# EAGLE board MCAT-CANYVAL-BPL-5X (EAGLE 7.2.0), part 1 of 2
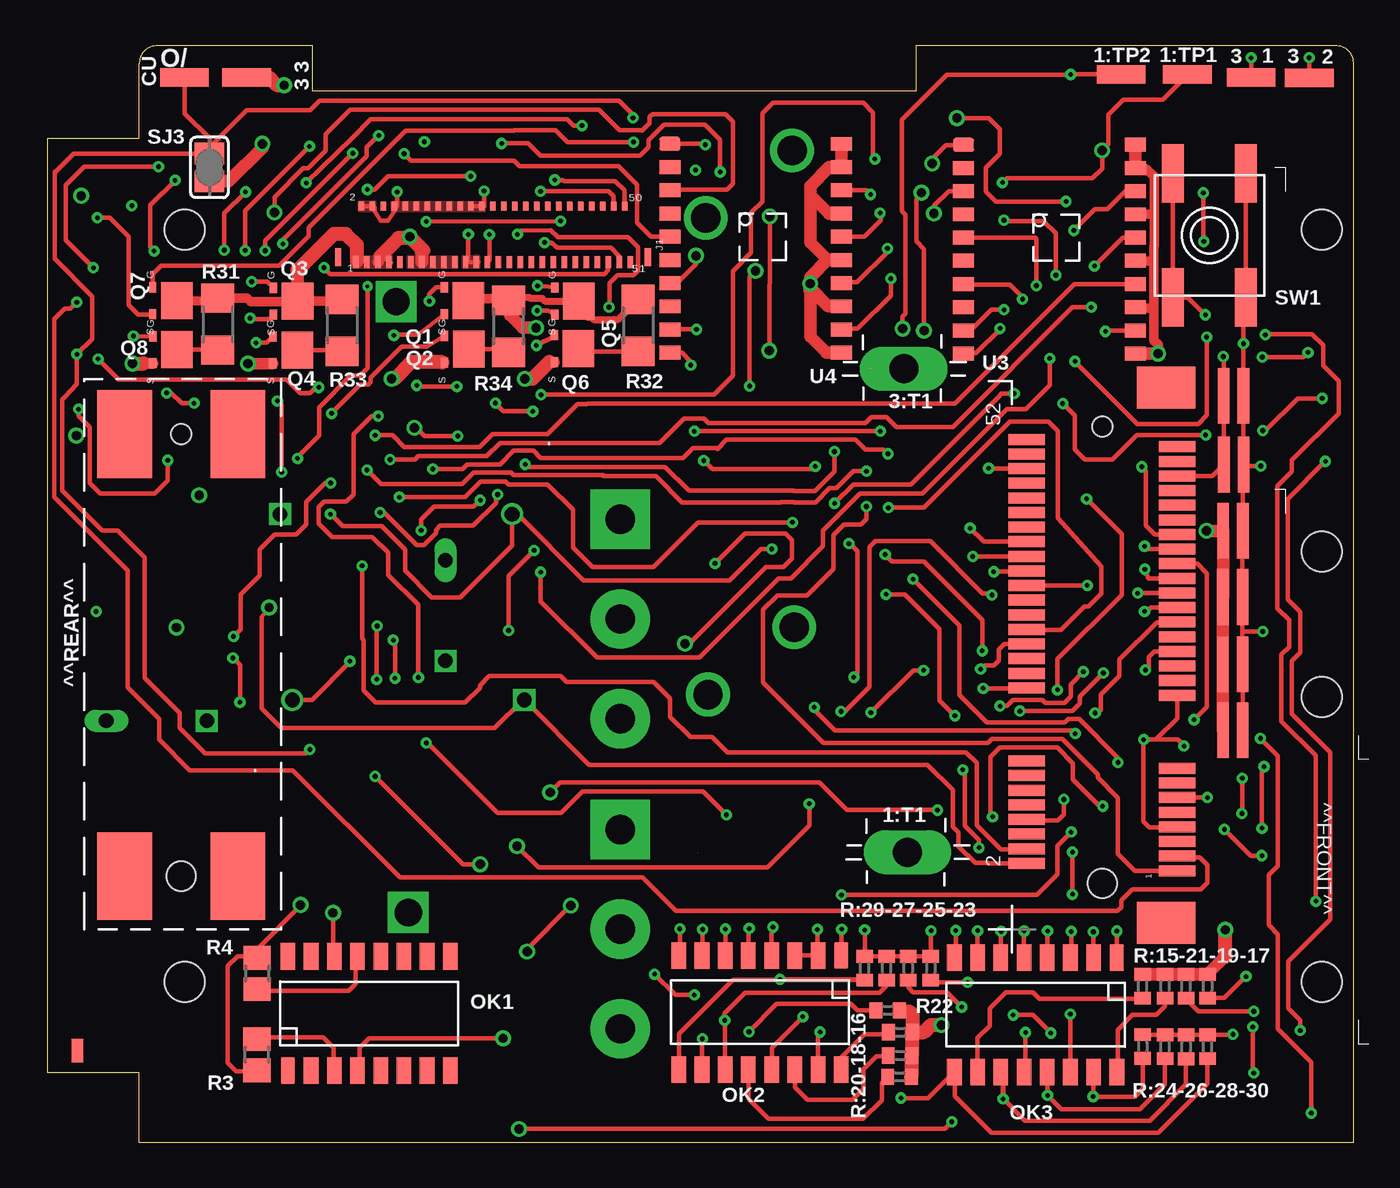
[diagram p4: board, top side]
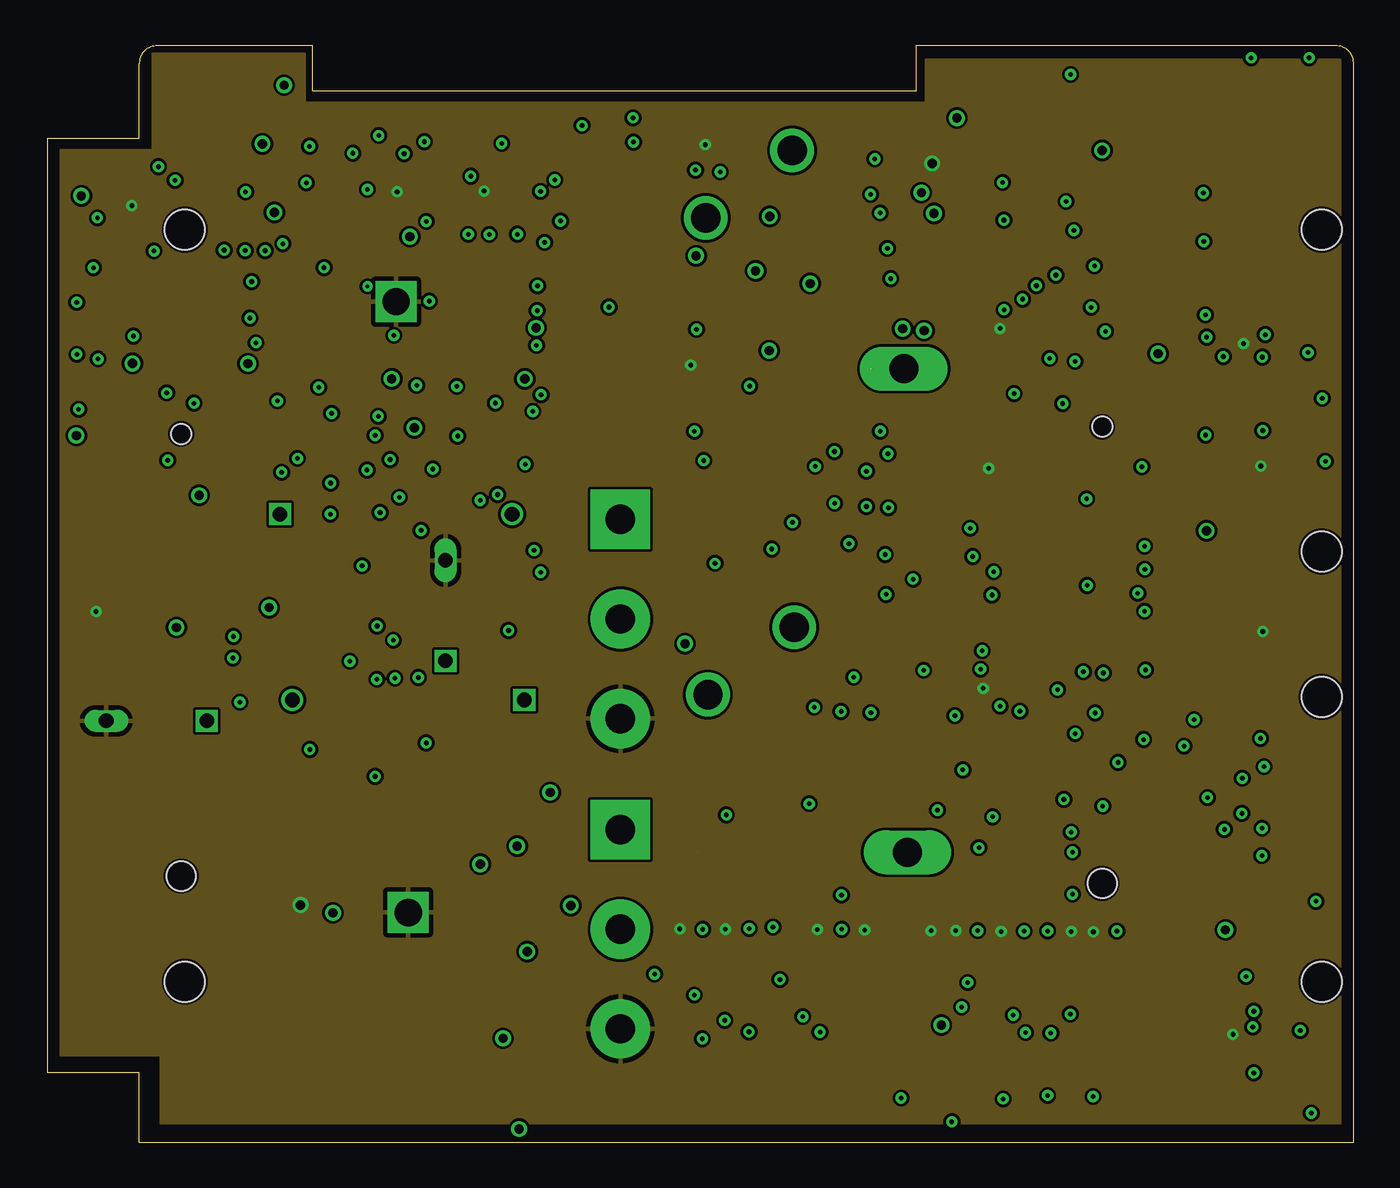
[diagram p5: board, inner layer L2/TopGround]
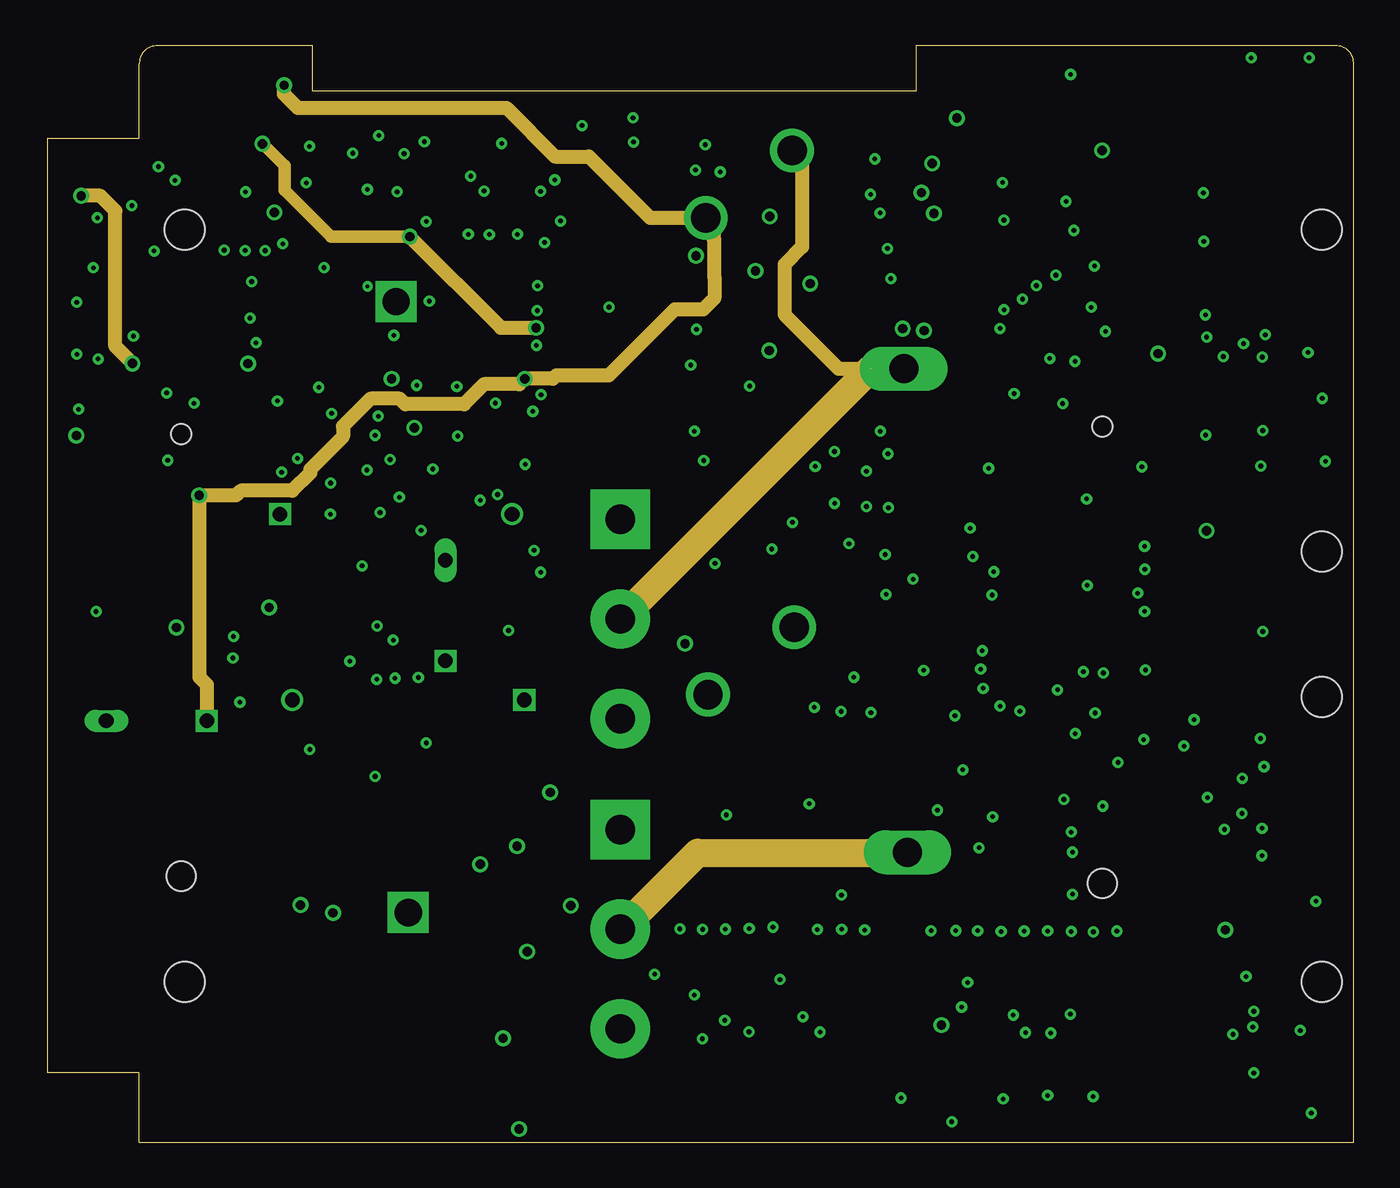
[diagram p6: board, inner layer L3/Power1]
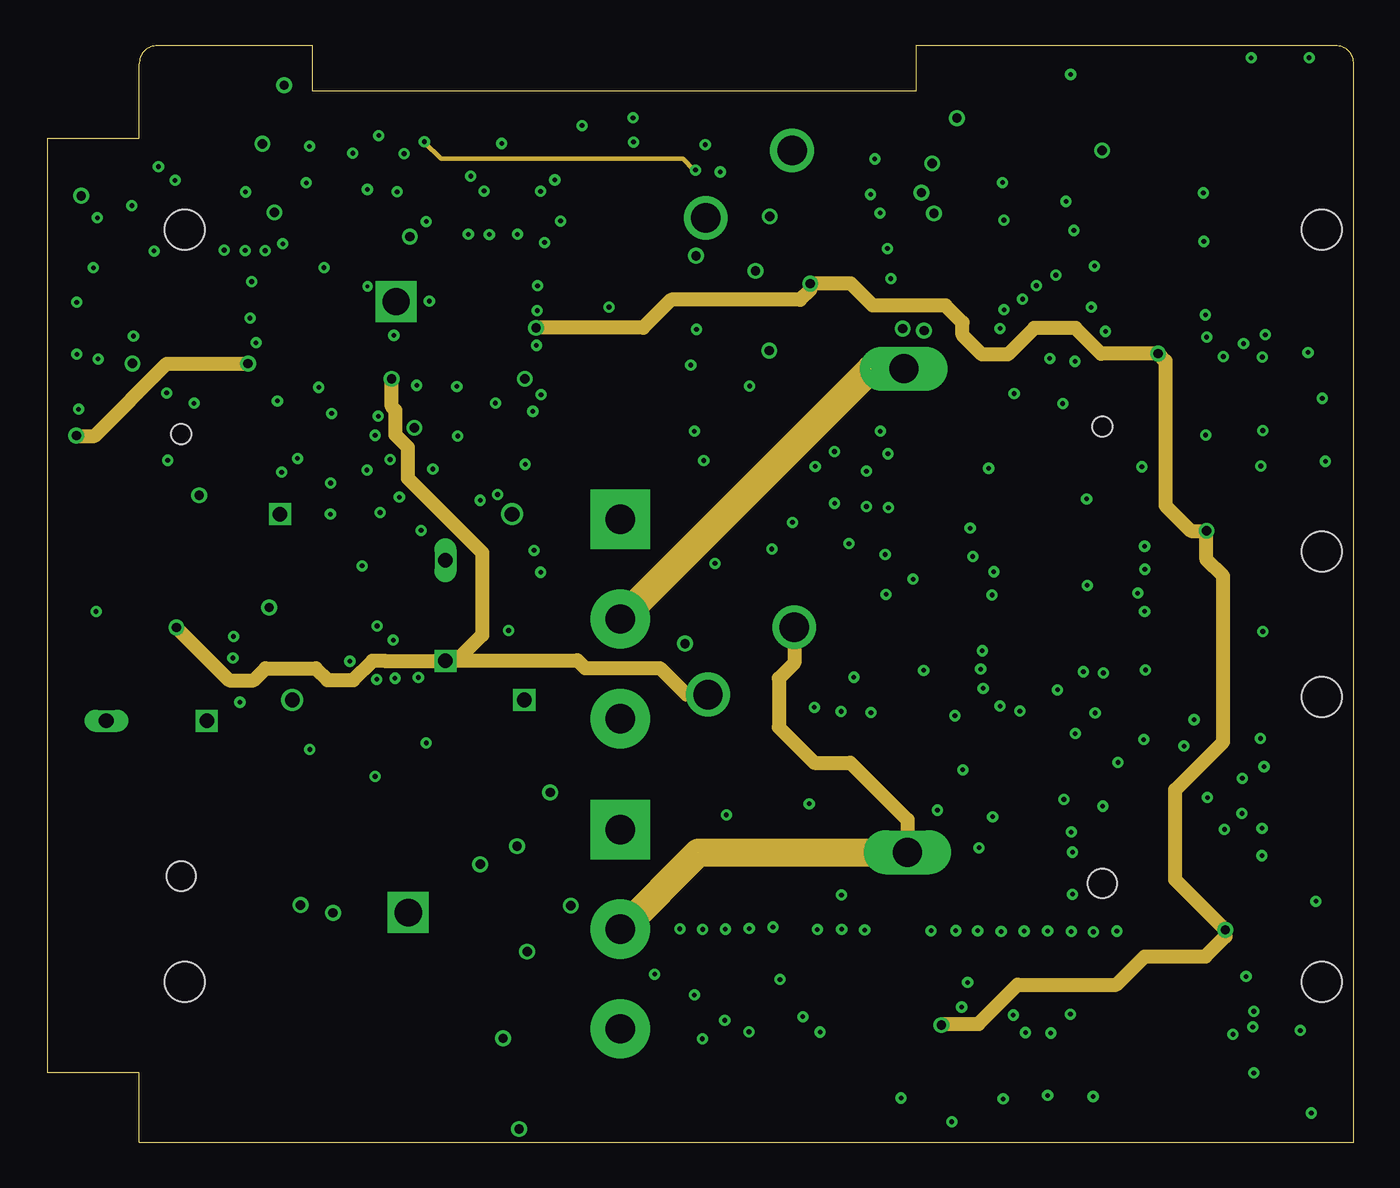
[diagram p7: board, inner layer L14/Power2]
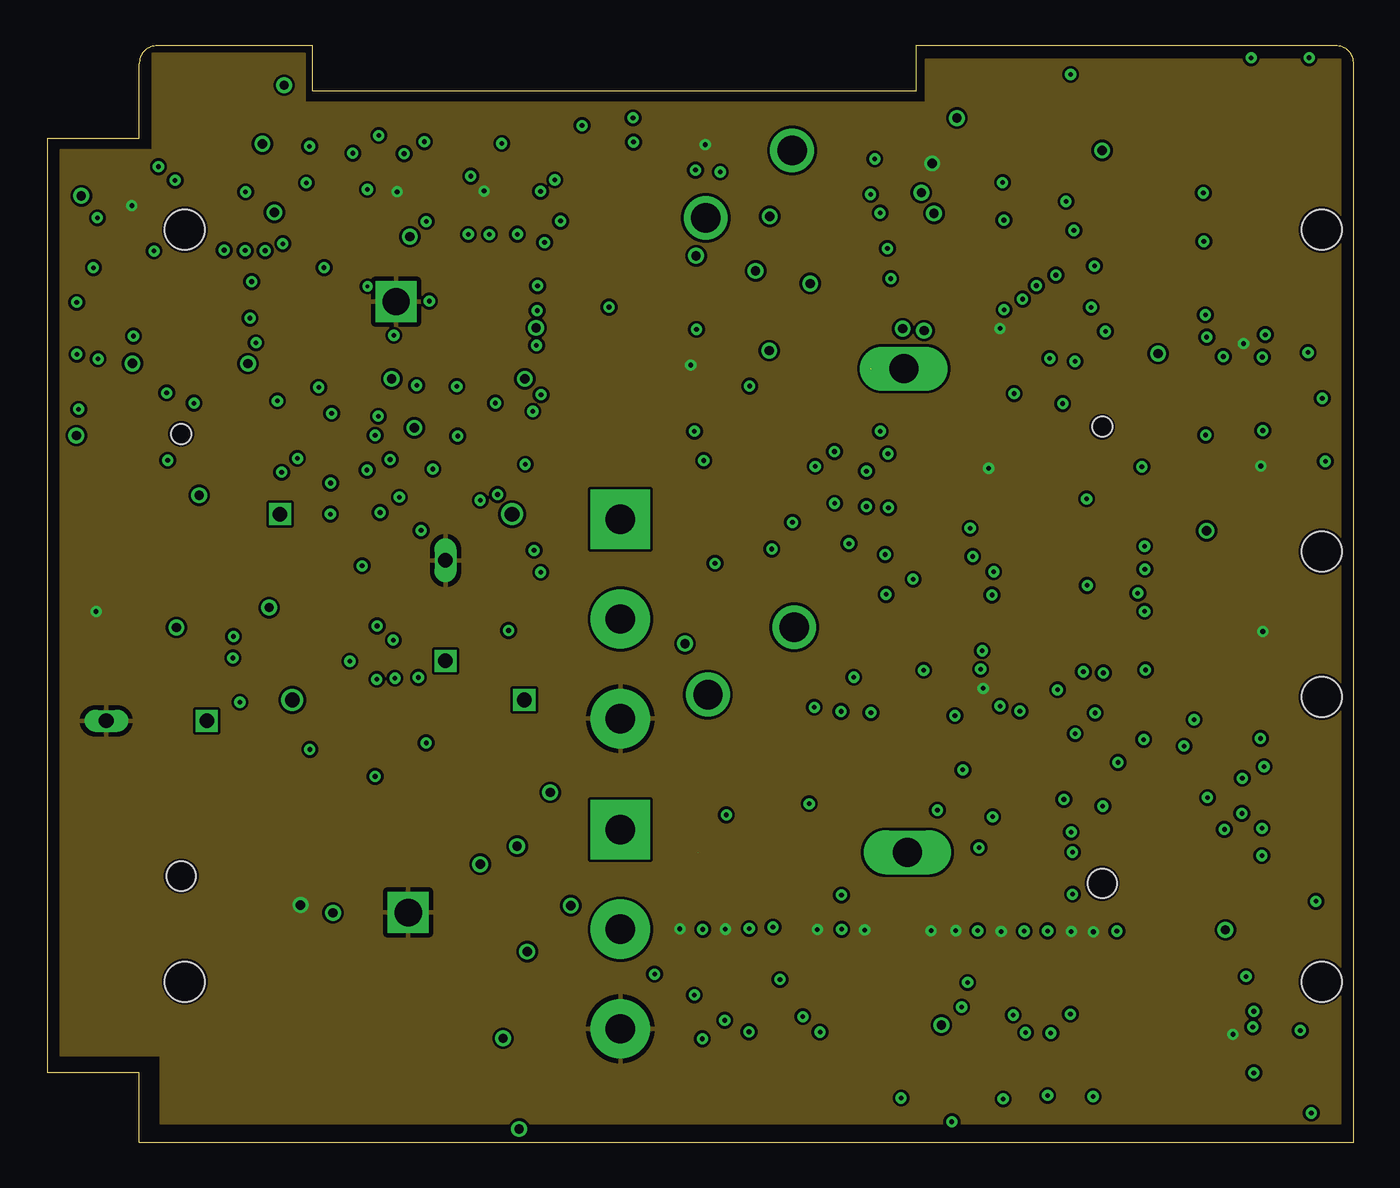
[diagram p8: board, inner layer L15/BottomGround]
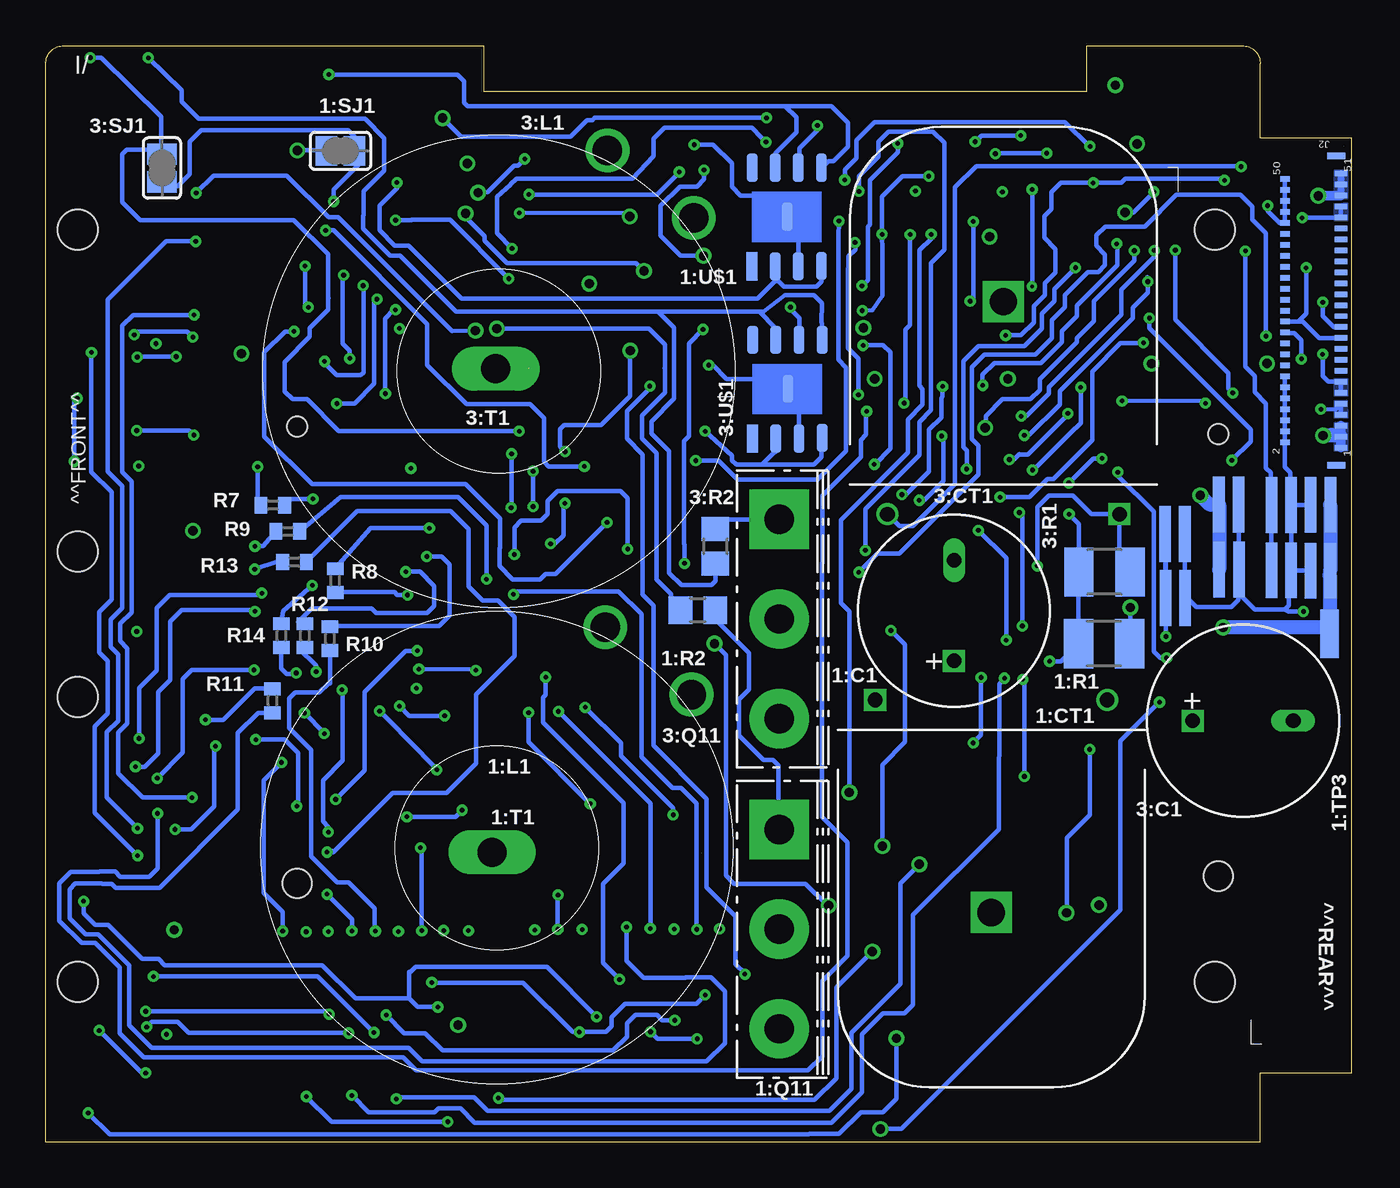
[diagram p9: board, bottom side, seen from below]

Size 71.47 x 60 mm. Coordinates in mm from the lower left corner, seen from the top.
Copper layers (1+2*3+14*15+16): L1/TopSignal 0.035559375mm / dielectric 3.5mil / L2/TopGround 0.01778125mm / dielectric 47mil / L3/Power1 0.0356mm / dielectric 12mil / L14/Power2 0.0356mm / dielectric 0.1499mm / L15/BottomGround 0.01778125mm / dielectric 3.5mil / L16/BottomSignal 0.035559375mm
Design rules "mcat-4cu-c *": minimum track width 2mil, minimum drill 8mil, track to track 6mil, track to pad 6mil, pad to pad 6mil, via to via 6mil, smd to smd 6mil, copper to edge 6mil, drill to drill 5mil, minimum pad ring 8mil, minimum via ring 4mil, stop-mask expansion 0mil, vias tented up to drill 8mil, thermal gap 10mil
Net classes: 1 P18H-0.6A-CKT: width 0.203 mm; 2 VOUTA-2A-CKT: width 1.016 mm; 3 P3-0.5A-CKT: width 0.254 mm; 4 TPOUT-0.25A-3MIL: width 0.076 mm; 5 power: width 0.406 mm

## Footprints (pad centres in the part's own frame; a part is rotated, then mirrored left to right if it is on the bottom)
MCAT-4CU-C-BPL-V4-BLANK = smd 0.635 x 1.27: GND -3.37,5.51
0612-REV = smd 3.05 x 0.635: 1 0,0; 2 0,1.077
LATCH_SD-48099-400 = smd 4.8 x 3: P$3 12.25,24.6; P$4 -11.95,24.6; P$5 -11.95,30.8; P$6 12.25,30.8 | hole 1.6: -11.95,27.7 | hole 1.1: 12.25,27.7
CONN_SD-67910-001 = smd 0.6 x 2: 1 -11.65,-26.8; 2 -11.248,-18.576; 3 -10.85,-26.8; 4 -10.447,-18.576; 5 -10.05,-26.8; 6 -9.648,-18.576; 7 -9.25,-26.8; 8 -8.848,-18.576; 9 -8.45,-26.8; 10 -8.047,-18.576; 11 -7.65,-26.8; 12 -7.247,-18.576; 13 -6.85,-26.8; 14 -6.447,-18.576; 15 -6.05,-26.8; 16 -5.647,-18.576; 17 -2.05,-26.8; 18 -1.647,-18.576; 19 -1.25,-26.8; 20 -0.848,-18.576; 21 -0.45,-26.8; 22 -0.048,-18.576; 23 0.35,-26.8; 24 0.752,-18.576; 25 1.15,-26.8; 26 1.552,-18.576; 27 1.95,-26.8; 28 2.353,-18.576; 29 2.75,-26.8; 30 3.152,-18.576; 31 3.55,-26.8; 32 3.953,-18.576; 33 4.35,-26.8; 34 4.753,-18.576; 35 5.15,-26.8; 36 5.553,-18.576; 37 5.95,-26.8; 38 6.353,-18.576; 39 6.75,-26.8; 40 7.152,-18.576; 41 7.55,-26.8; 42 7.952,-18.576; 43 8.35,-26.8; 44 8.752,-18.576; 45 9.15,-26.8; 46 9.553,-18.576; 47 9.95,-26.8; 48 10.352,-18.576; 49 10.75,-26.8; 50 11.152,-18.576; 51 11.55,-26.8; 52 11.953,-18.576 | smd 2.3 x 3.2: P$1 -14.5,-26.2; P$2 14.8,-26.2 | hole 1.6: -12.35,-22.7 | hole 1.1: 12.65,-22.7
SSOP(16PIN) = smd 0.8 x 1.45: 1 0,0; 2 1.27,0; 3 2.54,0; 4 3.81,0; 5 5.08,0; 6 6.35,0; 7 7.62,0; 8 8.89,0; 9 8.89,6.25; 10 7.62,6.25; 11 6.35,6.25; 12 5.08,6.25; 13 3.81,6.25; 14 2.54,6.25; 15 1.27,6.25; 16 0,6.25
R0805 = smd 1.3 x 1.5: 1 -0.85,0; 2 0.85,0
SJ = smd 1.168 x 1.6: 1 -0.762,0; 2 0.762,0
EVQ-Q2 = smd 3.2 x 1.2: A -3.4,-2; A' 3.4,-2; B -3.4,2; B' 3.4,2
PCB-MINI-SMD-TESTPOINT = smd 2.667 x 1.016: 1 0,0
SMTRA-M2-6-5-RA = hole 2.2: 0,0
MOLEX-502598-5193 = smd 0.3 x 0.67: 1 -7.5,0.135; 3 -6.9,0.135; 5 -6.3,0.135; 7 -5.7,0.135; 9 -5.1,0.135; 11 -4.5,0.135; 13 -3.9,0.135; 15 -3.3,0.135; 17 -2.7,0.135; 19 -2.1,0.135; 21 -1.5,0.135; 23 -0.9,0.135; 25 -0.3,0.135; 27 0.3,0.135; 29 0.9,0.135; 31 1.5,0.135; 33 2.1,0.135; 35 2.7,0.135; 37 3.3,0.135; 39 3.9,0.135; 41 4.5,0.135; 43 5.1,0.135; 45 5.7,0.135; 47 6.3,0.135; 49 6.9,0.135; 51 7.5,0.135 | smd 0.3 x 0.5: 2 -7.2,3.2; 4 -6.6,3.2; 6 -6,3.2; 8 -5.4,3.2; 10 -4.8,3.2; 12 -4.2,3.2; 14 -3.6,3.2; 16 -3,3.2; 18 -2.4,3.2; 20 -1.8,3.2; 22 -1.2,3.2; 24 -0.6,3.2; 26 0,3.2; 28 0.6,3.2; 30 1.2,3.2; 32 1.8,3.2; 34 2.4,3.2; 36 3,3.2; 38 3.6,3.2; 40 4.2,3.2; 42 4.8,3.2; 44 5.4,3.2; 46 6,3.2; 48 6.6,3.2; 50 7.2,3.2 | smd 0.35 x 1: 99 -8.475,0.4; 100 8.475,0.4
1206-8-CHIPFET = smd 2.032 x 1.727: D 0,1.321 | smd 0.559 x 0.406: G -0.736,0; S 0.736,0
R0402 = smd 0.7 x 0.9: 1 -0.65,0; 2 0.65,0
R1206 = smd 1.6 x 1.803: 1 -1.422,0; 2 1.422,0
20-LEAD-PLASTIC-SO = smd 0.762 x 1.143: 1 0,0; 2 1.27,0; 3 2.54,0; 4 3.81,0; 5 5.08,0; 6 6.35,0; 7 7.62,0; 8 8.89,0; 9 10.16,0; 10 11.43,0; 11 11.43,9.398; 12 10.16,9.398; 13 8.89,9.398; 14 7.62,9.398; 15 6.35,9.398; 16 5.08,9.398; 17 3.81,9.398; 18 2.54,9.398; 19 1.27,9.398; 20 0,9.398
CHEMI-CON-PSG-JB5 = drill 0.8 long: NEG -2.75,0 | drill 0.8 square: POS 2.75,0
MURATA-5600-SERIES-CURR-XFR-RA = drill 0.8 square: 1 2.04,-1.63 | drill 0.8: 3 14.74,-1.63 | drill 1.5 square: PPU-K 8.395,10
PPUV8-INDUCTOR-V2 = drill 1.6: 1 8.385,-10.656; 2 12.076,-5.932
IXYS-TO-247-AD-VERT = drill 1.6 pad 3.25: C 5.45,0; E 10.9,0 | drill 1.6 pad 3.25 square: G 0,0
R1210 = smd 1.6 x 2.7: 1 -1.4,0; 2 1.4,0
R0805' = smd 1.3 x 1.5: 1 -0.95,0; 2 0.95,0
SPADE-TERMINAL-FLANGED-NYLON-INSULATED = drill 1.6 long: T 0,0
IXYS-SI-8PIN-POWER-SOIC = smd 0.6 x 1.55: 1 0,0; 2 1.27,0; 3 2.54,0; 4 3.81,0.03; 5 3.81,5.4; 6 2.54,5.4; 7 1.27,5.4; 8 0.01,5.4; 9 1.94,2.72

## Placement (x,y rotation side)
B2  MCAT-4CU-C-PCB/BPL  [MCAT-4CU-C-BPL-V4-BLANK]  5,-0.5 0 top
CU-V2L1-1:BC3  BYPASS-CAP-1UF  [0612-REV]  64.34,40.84 270 top
CU-V2L1-1:BC4  BYPASS-CAP-0.1UF  [0612-REV]  64.36,37.08 270 top
CU-V2L1-1:J7  LATCH_NANO54415_MODULE  [LATCH_SD-48099-400]  35,26.5 90 top
CU-V2L1-1:J9  CONN_NANO54415_MODULE  [CONN_SD-67910-001]  35,26.5 90 top
CU-V2L1-1:OK1  PS2801C-4  [SSOP(16PIN)]  13.14,3.91 0 top
CU-V2L1-1:R3  560R  [R0805]  11.44,4.78 90 top
CU-V2L1-1:R4  1K2  [R0805]  11.46,9.22 270 top
CU-V2L1-1:SJ3  0R  [SJ]  8.85,53.34 90 top
CU-V2L1-1:SW1  SPST_TACT-EVQQ2  [EVQ-Q2]  63.57,49.62 270 top
CU-V2L1-1:TP1  PCB-MINI-SMD-TESTPOINT/SQ  [PCB-MINI-SMD-TESTPOINT]  7.47,58.27 180 top
F1  SMTRAM2-6-5-RA  [SMTRA-M2-6-5-RA]  69.72,8.77 0 top
F2  SMTRAM2-6-5-RA  [SMTRA-M2-6-5-RA]  69.72,32.31 180 top
F3  SMTRAM2-6-5-RA  [SMTRA-M2-6-5-RA]  69.72,49.92 180 top
F4  SMTRAM2-6-5-RA  [SMTRA-M2-6-5-RA]  7.5,8.77 0 bottom
F5  SMTRAM2-6-5-RA  [SMTRA-M2-6-5-RA]  7.5,49.92 180 bottom
F6  SMTRAM2-6-5-RA  [SMTRA-M2-6-5-RA]  69.72,24.35 0 top
J1  MOLEX-502598-5193  [MOLEX-502598-5193]  24.36,48.03 0 top
J2  MOLEX-502598-5193  [MOLEX-502598-5193]  0.45,45.5 90 bottom
PD-V2L1-1:BC1  BYPASS-CAP-0.1UF  [0612-REV]  64.3,26.15 270 top
PD-V2L1-1:BC2  BYPASS-CAP-1UF  [0612-REV]  64.3,29.83 270 top
PD-V2L1-1:BC3  BYPASS-CAP-1UF  [0612-REV]  64.31,22.54 270 top
PD-V2L1-1:BC4  BYPASS-CAP-0.1UF  [0612-REV]  64.32,33.46 270 top
PD-V2L1-1:OK2  PS2801C-4  [SSOP(16PIN)]  43.42,10.21 180 top
PD-V2L1-1:OK3  PS2801C-4  [SSOP(16PIN)]  58.5,10.09 180 top
PD-V2L1-1:Q1  SI5404BDC  [1206-8-CHIPFET]  21.7,46.04 270 top
PD-V2L1-1:Q2  SI5404BDC  [1206-8-CHIPFET]  21.71,43.38 270 top
PD-V2L1-1:Q3  SI5404BDC  [1206-8-CHIPFET]  12.35,46.01 270 top
PD-V2L1-1:Q4  SI5404BDC  [1206-8-CHIPFET]  12.33,43.35 270 top
PD-V2L1-1:Q5  SI5404BDC  [1206-8-CHIPFET]  27.74,46.02 270 top
PD-V2L1-1:Q6  SI5404BDC  [1206-8-CHIPFET]  27.72,43.42 270 top
PD-V2L1-1:Q7  SI5404BDC  [1206-8-CHIPFET]  5.74,46.04 270 top
PD-V2L1-1:Q8  SI5404BDC  [1206-8-CHIPFET]  5.75,43.36 270 top
PD-V2L1-1:R7  5K42  [R0402]  59.04,34.86 180 bottom
PD-V2L1-1:R8  5K42  [R0402]  55.63,30.73 90 bottom
PD-V2L1-1:R9  5K42  [R0402]  58.23,33.42 180 bottom
PD-V2L1-1:R10  5K42  [R0402]  55.91,27.55 90 bottom
PD-V2L1-1:R11  5K42  [R0402]  59.06,24.14 90 bottom
PD-V2L1-1:R12  5K42  [R0402]  57.28,27.72 90 bottom
PD-V2L1-1:R13  5K42  [R0402]  57.86,31.74 180 bottom
PD-V2L1-1:R14  5K42%  [R0402]  58.57,27.71 90 bottom
PD-V2L1-1:R15  100k  [R0402]  59.91,8.53 270 top
PD-V2L1-1:R16  100k  [R0402]  46.66,6.01 180 top
PD-V2L1-1:R17  100k  [R0402]  63.46,8.53 270 top
PD-V2L1-1:R18  100k  [R0402]  46.63,4.73 180 top
PD-V2L1-1:R19  100k  [R0402]  62.28,8.52 270 top
PD-V2L1-1:R20  100k  [R0402]  46.61,3.57 180 top
PD-V2L1-1:R21  100k  [R0402]  61.13,8.53 270 top
PD-V2L1-1:R22  100k  [R0402]  45.96,7.21 180 top
PD-V2L1-1:R23  51k  [R0402]  48.32,9.51 270 top
PD-V2L1-1:R24  51k  [R0402]  59.92,5.23 270 top
PD-V2L1-1:R25  51k  [R0402]  47.09,9.51 270 top
PD-V2L1-1:R26  51k  [R0402]  61.13,5.22 270 top
PD-V2L1-1:R27  51k  [R0402]  45.9,9.51 270 top
PD-V2L1-1:R28  51k  [R0402]  62.29,5.21 270 top
PD-V2L1-1:R29  51k  [R0402]  44.69,9.51 270 top
PD-V2L1-1:R30  51k  [R0402]  63.46,5.22 270 top
PD-V2L1-1:R31  0.1R  [R1206]  9.3,44.76 90 top
PD-V2L1-1:R32  0.1R  [R1206]  32.31,44.69 90 top
PD-V2L1-1:R33  0.1R  [R1206]  16.1,44.69 90 top
PD-V2L1-1:R34  0.1R  [R1206]  25.2,44.64 90 top
PD-V2L1-1:U3  LT1161ISW  [20-LEAD-PLASTIC-SO]  50.11,54.58 270 top
PD-V2L1-1:U4  LT1161ISW  [20-LEAD-PLASTIC-SO]  34.04,54.62 270 top
PPU-V8C1-1:BC1  BYPASS-CAP-0.1UF  [0612-REV]  1.17,34.88 90 bottom
PPU-V8C1-1:BC2  BYPASS-CAP-1UF  [0612-REV]  1.17,31.26 90 bottom
PPU-V8C1-1:BC3  BYPASS-CAP-0.1UF  [0612-REV]  4.39,34.86 270 bottom
PPU-V8C1-1:BC4  BYPASS-CAP-1UF  [0612-REV]  4.39,31.29 270 bottom
PPU-V8C1-1:C1  680uF/20WV  [CHEMI-CON-PSG-JB5]  21.76,29.08 270 bottom
PPU-V8C1-1:CT1  MURATA-5600-CURR-XFR/RA  [MURATA-5600-SERIES-CURR-XFR-RA]  28.12,22.57 180 top
PPU-V8C1-1:L1  PPUV8-INDUCTOR-V2  [PPUV8-INDUCTOR-V2]  46.78,16.1 90 bottom
PPU-V8C1-1:Q11  IXYH30N120C3D1  [IXYS-TO-247-AD-VERT]  31.33,17.1 270 bottom
PPU-V8C1-1:R1  15R  [R1210]  13.55,27.27 180 bottom
PPU-V8C1-1:R2  1K  [R0805']  35.78,29.11 0 bottom
PPU-V8C1-1:SJ1  0R  [SJ]  55.34,54.24 180 bottom
PPU-V8C1-1:T1  MCAT-SPADE-TERMINAL  [SPADE-TERMINAL-FLANGED-NYLON-INSULATED]  47.05,15.86 0 top
PPU-V8C1-1:TP1  PCB-MINI-SMD-TESTPOINT/SQ  [PCB-MINI-SMD-TESTPOINT]  62.36,58.43 0 top
PPU-V8C1-1:TP2  PCB-MINI-SMD-TESTPOINT/SQ  [PCB-MINI-SMD-TESTPOINT]  58.74,58.43 180 top
PPU-V8C1-1:TP3  PCB-MINI-SMD-TESTPOINT/SQ  [PCB-MINI-SMD-TESTPOINT]  1.21,27.81 90 bottom
PPU-V8C1-1:U$1  IXDN604/SI  [IXYS-SI-8PIN-POWER-SOIC]  32.82,47.92 0 bottom
PPU-V8C1-3:BC1  BYPASS-CAP-0.1UF  [0612-REV]  7.25,31.33 270 bottom
PPU-V8C1-3:BC2  BYPASS-CAP-1UF  [0612-REV]  7.27,34.89 270 bottom
PPU-V8C1-3:BC3  BYPASS-CAP-0.1UF  [0612-REV]  10.21,33.28 270 bottom
PPU-V8C1-3:BC4  BYPASS-CAP-1UF  [0612-REV]  10.19,29.77 270 bottom
PPU-V8C1-3:C1  680uF/20WV  [CHEMI-CON-PSG-JB5]  5.95,23.05 180 bottom
PPU-V8C1-3:CT1  MURATA-5600-CURR-XFR/RA  [MURATA-5600-SERIES-CURR-XFR-RA]  10.67,35.99 0 top
PPU-V8C1-3:L1  PPUV8-INDUCTOR-V2  [PPUV8-INDUCTOR-V2]  46.66,42.19 90 bottom
PPU-V8C1-3:Q11  IXYH30N120C3D1  [IXYS-TO-247-AD-VERT]  31.33,34.07 270 bottom
PPU-V8C1-3:R1  15R  [R1210]  13.52,31.2 180 bottom
PPU-V8C1-3:R2  1K  [R0805']  34.82,32.6 90 bottom
PPU-V8C1-3:SJ1  0R  [SJ]  65.1,53.3 90 bottom
PPU-V8C1-3:T1  MCAT-SPADE-TERMINAL  [SPADE-TERMINAL-FLANGED-NYLON-INSULATED]  46.84,42.32 0 top
PPU-V8C1-3:TP1  PCB-MINI-SMD-TESTPOINT/SQ  [PCB-MINI-SMD-TESTPOINT]  69.04,58.24 0 top
PPU-V8C1-3:TP2  PCB-MINI-SMD-TESTPOINT/SQ  [PCB-MINI-SMD-TESTPOINT]  65.85,58.27 0 top
PPU-V8C1-3:TP3  PCB-MINI-SMD-TESTPOINT/SQ  [PCB-MINI-SMD-TESTPOINT]  10.88,58.27 0 top
PPU-V8C1-3:U$1  IXDN604/SI  [IXYS-SI-8PIN-POWER-SOIC]  32.79,38.5 0 bottom